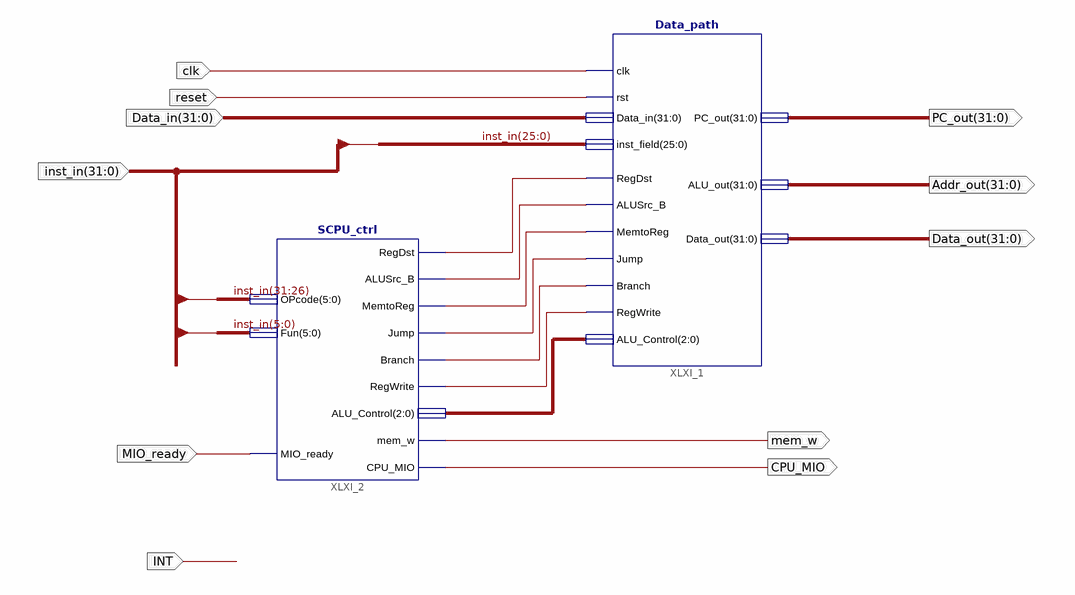
[diagram p0: schematic sheet 1]
// Xilinx ISE schematic SCPU.sch (kintex7) as structural Verilog: 2 symbols, 11 ports
module SCPU (
  input  clk,
  input  reset,
  input  [31:0] Data_in,
  input  [31:0] inst_in,
  input  MIO_ready,
  input  INT,
  output mem_w,
  output CPU_MIO,
  output [31:0] PC_out,
  output [31:0] Addr_out,
  output [31:0] Data_out
);

  wire XLXN_7, XLXN_8, XLXN_9, XLXN_10, XLXN_11, XLXN_12;
  wire [2:0] XLXN_13;

  Data_path XLXI_1 (
    .RegDst(XLXN_7), .ALUSrc_B(XLXN_8), .MemtoReg(XLXN_9), .Jump(XLXN_10), .Branch(XLXN_11),
    .RegWrite(XLXN_12), .ALU_Control(XLXN_13), .Data_in(Data_in), .inst_field(inst_in[25:0]), .clk(clk),
    .rst(reset), .PC_out(PC_out), .ALU_out(Addr_out), .Data_out(Data_out));
  SCPU_ctrl XLXI_2 (
    .RegDst(XLXN_7), .ALUSrc_B(XLXN_8), .MemtoReg(XLXN_9), .Jump(XLXN_10), .Branch(XLXN_11),
    .RegWrite(XLXN_12), .ALU_Control(XLXN_13), .CPU_MIO(CPU_MIO), .mem_w(mem_w), .Fun(inst_in[5:0]),
    .MIO_ready(MIO_ready), .OPcode(inst_in[31:26]));
endmodule
